# Altium schematic sheet 起跑.SchDoc
size A4
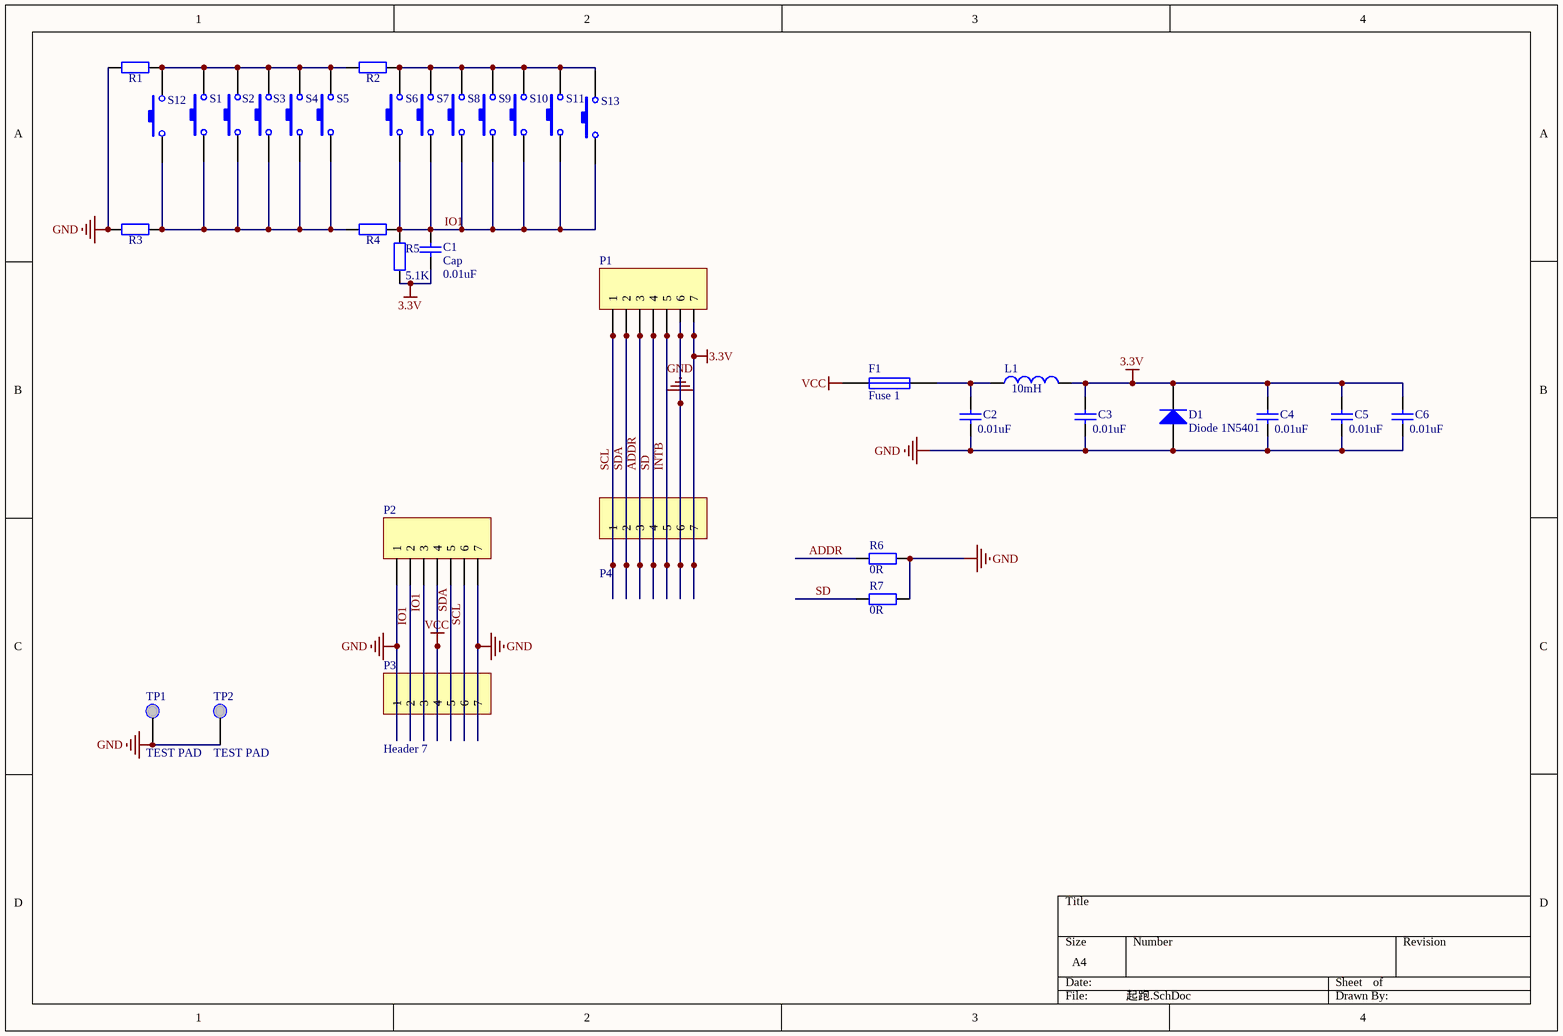
[diagram p0: 起跑.SchDoc]

## Parts
C1  Cap  value 0.01uF  [C2012]
C2  value 0.01uF  [c2012]  (hidden comment: Cap)
C3  value 0.01uF  [C2012]  (hidden comment: Cap)
C4  value 0.01uF  [C2012]  (hidden comment: Cap)
C5  value 0.01uF  [C2012]  (hidden comment: Cap)
C6  value 0.01uF  [C2012]  (hidden comment: Cap)
D1  Diode 1N5401  [1206(2)]
F1  Fuse 1  [r2012]
L1  value 10mH  [r2012]  (hidden comment: Inductor)
P1  Header 7H  [HDR1X7H]  (value not drawn)
P2  Header 7  [HDR1X7]  (value not drawn)
P3  Header 7  [FFC/SM1.0-2H7]
P4  Header 7  [HDR1X7]  (value not drawn)
R1  Res2  [R2012]  (value not drawn)
R2  Res2  [R2012]  (value not drawn)
R3  Res2  [R2012]  (value not drawn)
R4  Res2  [R2012]  (value not drawn)
R5  value 5.1K  [R2012]  (hidden comment: Res2)
R6  0R  [1206(2)]
R7  0R  [1206(2)]
S1  SW-PB  [AXIAL-0.9]  (value not drawn)
S2  SW-PB  [AXIAL-0.9]  (value not drawn)
S3  SW-PB  [AXIAL-0.9]  (value not drawn)
S4  SW-PB  [AXIAL-0.9]  (value not drawn)
S5  SW-PB  [AXIAL-0.9]  (value not drawn)
S6  SW-PB  [AXIAL-0.9]  (value not drawn)
S7  SW-PB  [AXIAL-0.9]  (value not drawn)
S8  SW-PB  [AXIAL-0.9]  (value not drawn)
S9  SW-PB  [AXIAL-0.9]  (value not drawn)
S10  SW-PB  [AXIAL-0.9]  (value not drawn)
S11  SW-PB  [AXIAL-0.9]  (value not drawn)
S12  SW-PB  [AXIAL-0.9]  (value not drawn)
S13  SW-PB  [AXIAL-0.9]  (value not drawn)
TP1  TEST PAD  [M3]
TP2  TEST PAD  [M3]

## Nets
3.3V: C1.1 C3.2 C4.2 C5.2 C6.2 D1.2(K) L1.2 P1.7 P4.7 R5.1
GND: C2.1 C3.1 C4.1 C5.1 C6.1 D1.1(A) P1.6 P2.1 P2.7 P3.1 P3.7 P4.6 R1.2 R3.2 R6.2 R7.2 TP1.1 TP2.1
VCC: F1.1 P2.4 P3.4
ADDR: P1.3 P4.3 R6.1
INTB: P1.5 P4.5
IO1: C1.2 P2.2 P2.3 P3.2 P3.3 R4.1 R5.2 S6.1 S7.1 S8.1 S9.1 S10.1 S11.1 S13.1
SCL: P1.1 P2.6 P3.6 P4.1
SD: P1.4 P4.4 R7.1
SDA: P1.2 P2.5 P3.5 P4.2
NetC2_2: C2.2 F1.2 L1.1
NetR1_1: R1.1 R2.2 S1.2 S2.2 S3.2 S4.2 S5.2 S12.2
NetR2_1: R2.1 S6.2 S7.2 S8.2 S9.2 S10.2 S11.2 S13.2
NetR3_1: R3.1 R4.2 S1.1 S2.1 S3.1 S4.1 S5.1 S12.1

## Library data of the parts
C1-C6 = Cap: Capacitor; Published: 8-Jun-2000; LatestRevisionDate: 17-Jul-2002; LatestRevisionNote: Re-released for DXP Platform.; PackageReference: RAD-0.3; Publisher: Altium Limited
D1 = Diode 1N5401: 3 Amp General Purpose Rectifier; Published: 8-Jun-2000; LatestRevisionDate: 17-Jul-2002; LatestRevisionNote: Re-released for DXP Platform.; DatasheetVersion: 1998; PackageVersion: Aug-1999; PackageReference: DO-201AD; Publisher: Altium Limited; PackageDescription: Diode, Axial; Body 9.5 x 5.6 mm (LxDia. max), Lead Dia. 1.32 mm (max); ComponentLink1Description: Manufacturer Link; ComponentLink1URL: http://www.fairchildsemi.com/; ComponentLink2Description: Datasheet; ComponentLink2URL: http://www.fairchildsemi.com/ds/1N%2F1N5400.pdf
F1 = Fuse 1: Fuse; Published: 8-Jun-2000; LatestRevisionDate: 17-Jul-2002; LatestRevisionNote: Re-released for DXP Platform.; PackageReference: PIN-W2/E2.8; Publisher: Altium Limited; PackageDescription: Thru-Hole; 2 Leads
L1 = Inductor: Code_IEC: 1005; Published: 8-Jun-2000; LatestRevisionDate: 29-May-2009; LatestRevisionNote: IPC-7351 Footprint Added.; PackageReference: 0402-A; Publisher: Altium Limited; PackageDescription: Chip Inductor; Code_JEITA: 0402
P1 = Header 7H: Header, 7-Pin, Right Angle; LatestRevisionDate: 17-Jul-2002; LatestRevisionNote: Re-released for DXP Platform.; Publisher: Altium Limited
P2-P4 = Header 7: Header, 7-Pin; LatestRevisionDate: 17-Jul-2002; LatestRevisionNote: Re-released for DXP Platform.; Publisher: Altium Limited
R1-R4 = Res2: Resistor; Value: 5.1K; Published: 8-Jun-2000; LatestRevisionDate: 17-Jul-2002; LatestRevisionNote: Re-released for DXP Platform.; PackageReference: AXIAL-0.4; Publisher: Altium Limited
R5 = Res2: Resistor; Published: 8-Jun-2000; LatestRevisionDate: 17-Jul-2002; LatestRevisionNote: Re-released for DXP Platform.; PackageReference: AXIAL-0.4; Publisher: Altium Limited
R6 R7 = Res: Resistor
S1-S13 = SW-PB: Switch; Published: 24-Mar-1999; LatestRevisionDate: 17-Jul-2002; LatestRevisionNote: Re-released for DXP Platform.; PackageReference: SPST-2; Publisher: Altium Limited